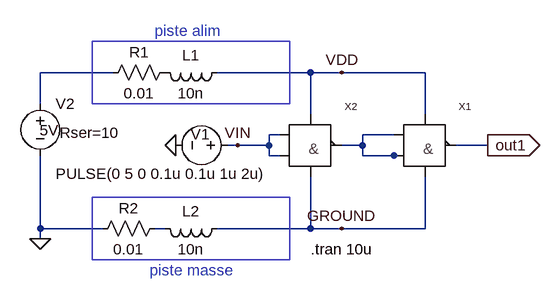
[diagram p0: schematic longeur_piste_inverseur.asc]
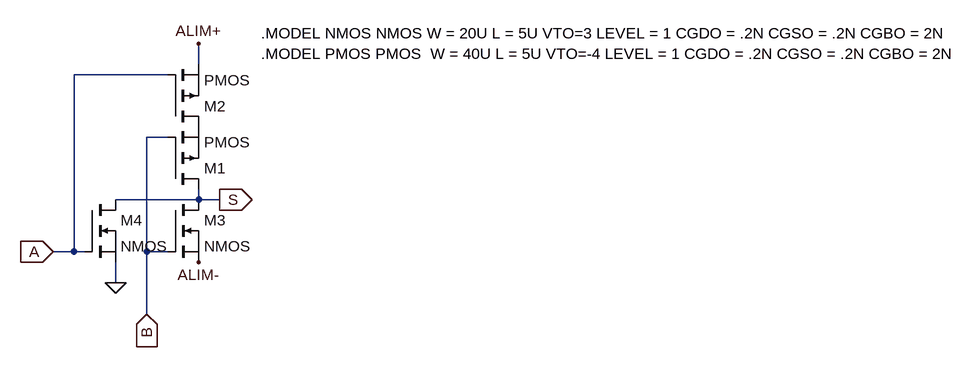
[diagram p1: sub-circuit 74hc00.asc]
longeur_piste_inverseur.asc, the LTspice schematic file:
Version 4
SHEET 1 892 692
WIRE 112 48 0 48
WIRE 416 48 272 48
WIRE 464 48 416 48
WIRE 592 48 464 48
WIRE 0 96 0 48
WIRE 416 112 416 48
WIRE 592 112 592 48
WIRE 368 144 352 144
WIRE 544 144 496 144
WIRE 304 160 288 160
WIRE 352 160 352 144
WIRE 352 160 304 160
WIRE 496 160 496 144
WIRE 496 160 464 160
WIRE 688 160 640 160
WIRE 352 176 352 160
WIRE 368 176 352 176
WIRE 496 176 496 160
WIRE 544 176 496 176
WIRE 560 176 544 176
WIRE 0 288 0 176
WIRE 96 288 0 288
WIRE 192 288 176 288
WIRE 416 288 416 208
WIRE 416 288 272 288
WIRE 464 288 416 288
WIRE 592 288 592 208
WIRE 592 288 464 288
WIRE 0 304 0 288
FLAG 208 160 0
FLAG 304 160 VIN
FLAG 688 160 out1
IOPIN 688 160 Out
FLAG 0 304 0
FLAG 464 48 VDD
FLAG 464 288 GROUND
SYMBOL voltage 304 160 R90
WINDOW 123 0 0 Left 0
WINDOW 39 -19 182 VRight 0
WINDOW 0 -17 43 VRight 0
WINDOW 3 44 -44 VRight 0
SYMATTR SpiceLine Rser=10
SYMATTR InstName V1
SYMATTR Value PULSE(0 5 0 0.1u 0.1u 1u 2u)
SYMBOL 74HC00 416 144 R0
SYMATTR InstName X2
SYMBOL voltage 0 80 R0
WINDOW 123 0 0 Left 0
WINDOW 39 0 0 Left 0
WINDOW 3 -1 57 Left 0
SYMATTR InstName V2
SYMATTR Value 5V
SYMBOL 74HC00 592 144 R0
SYMATTR InstName X1
SYMBOL res 208 32 R90
WINDOW 0 0 56 VBottom 0
WINDOW 3 32 56 VTop 0
SYMATTR InstName R1
SYMATTR Value 0.01
SYMBOL ind 288 32 R90
WINDOW 0 5 56 VBottom 0
WINDOW 3 32 56 VTop 0
SYMATTR InstName L1
SYMATTR Value 10n
SYMBOL res 192 272 R90
WINDOW 0 0 56 VBottom 0
WINDOW 3 32 56 VTop 0
SYMATTR InstName R2
SYMATTR Value 0.01
SYMBOL ind 288 272 R90
WINDOW 0 5 56 VBottom 0
WINDOW 3 32 56 VTop 0
SYMATTR InstName L2
SYMATTR Value 10n
TEXT 416 320 Left 0 !.tran 10u
TEXT 176 -16 Left 0 ;piste alim
TEXT 168 352 Left 0 ;piste masse
RECTANGLE Normal 384 96 80 0
RECTANGLE Normal 384 336 80 240

74hc00.asc, the sub-circuit schematic file:
Version 4
SHEET 1 1612 680
WIRE 304 16 304 -16
WIRE 256 32 112 32
WIRE 256 128 224 128
WIRE 304 224 304 208
WIRE 304 224 176 224
WIRE 336 224 304 224
WIRE 112 304 112 32
WIRE 112 304 80 304
WIRE 128 304 112 304
WIRE 224 304 224 128
WIRE 256 304 224 304
WIRE 176 352 176 320
WIRE 224 400 224 304
FLAG 336 224 S
IOPIN 336 224 Out
FLAG 224 400 B
IOPIN 224 400 In
FLAG 176 352 0
FLAG 80 304 A
IOPIN 80 304 In
FLAG 304 -16 ALIM+
FLAG 304 320 ALIM-
SYMBOL pmos 256 112 M180
SYMATTR InstName M2
SYMBOL pmos 256 208 M180
SYMATTR InstName M1
SYMBOL nmos 256 224 R0
SYMATTR InstName M3
SYMBOL nmos 128 224 R0
SYMATTR InstName M4
TEXT 400 -32 Left 0 !.MODEL NMOS NMOS W = 20U L = 5U VTO=3 LEVEL = 1 CGDO = .2N CGSO = .2N CGBO = 2N\n.MODEL PMOS PMOS  W = 40U L = 5U VTO=-4 LEVEL = 1 CGDO = .2N CGSO = .2N CGBO = 2N

The netlist it stands for:
* longeur_piste_inverseur.asc
V1 VIN 0 PULSE(0 5 0 0.1u 0.1u 1u 2u) Rser=10
XX2 VIN VIN VDD GROUND N002 74hc00 params: 74HC00
V2 N001 0 5V
XX1 N002 N002 VDD GROUND out1 74hc00 params: 74HC00
R1 P001 N001 0.01
L1 VDD P001 10n
R2 N003 0 0.01
L2 GROUND N003 10n

* block symbol definitions
.subckt 74hc00 A B ALIM+ ALIM- S
M2 P001 A ALIM+ ALIM+ PMOS
M1 S B P001 P001 PMOS
M3 S B ALIM- ALIM- NMOS
M4 S A 0 0 NMOS
.MODEL NMOS NMOS W = 20U L = 5U VTO=3 LEVEL = 1 CGDO = .2N CGSO = .2N CGBO = 2N
.MODEL PMOS PMOS  W = 40U L = 5U VTO=-4 LEVEL = 1 CGDO = .2N CGSO = .2N CGBO = 2N
.ends 74hc00

.model NMOS NMOS
.model PMOS PMOS
.lib standard.mos
.tran 10u
* piste alim
* piste masse
.backanno
.end